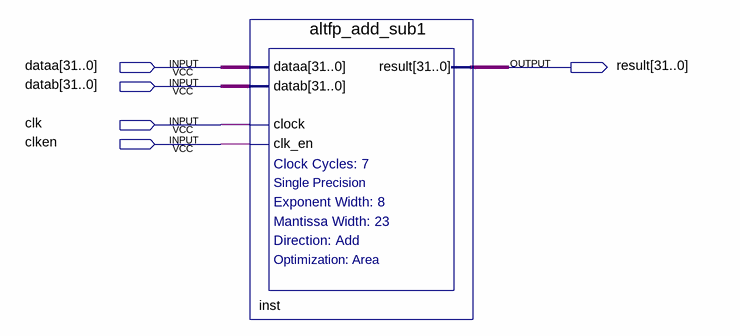
[diagram p0: schematic sheet]
// Quartus schematic FloatAdd.bdf as structural Verilog: 1 symbols, 5 pins
module FloatAdd (
  input  [31:0] dataa,
  input  [31:0] datab,
  input  clk,
  input  clken,
  output [31:0] result
);

  altfp_add_sub1 inst (.dataa(dataa), .datab(datab), .clock(clk), .clk_en(clken), .result(result));
endmodule
